# Altium schematic sheet Simple_Foc_Core.schdoc
size 278 x 207 mm
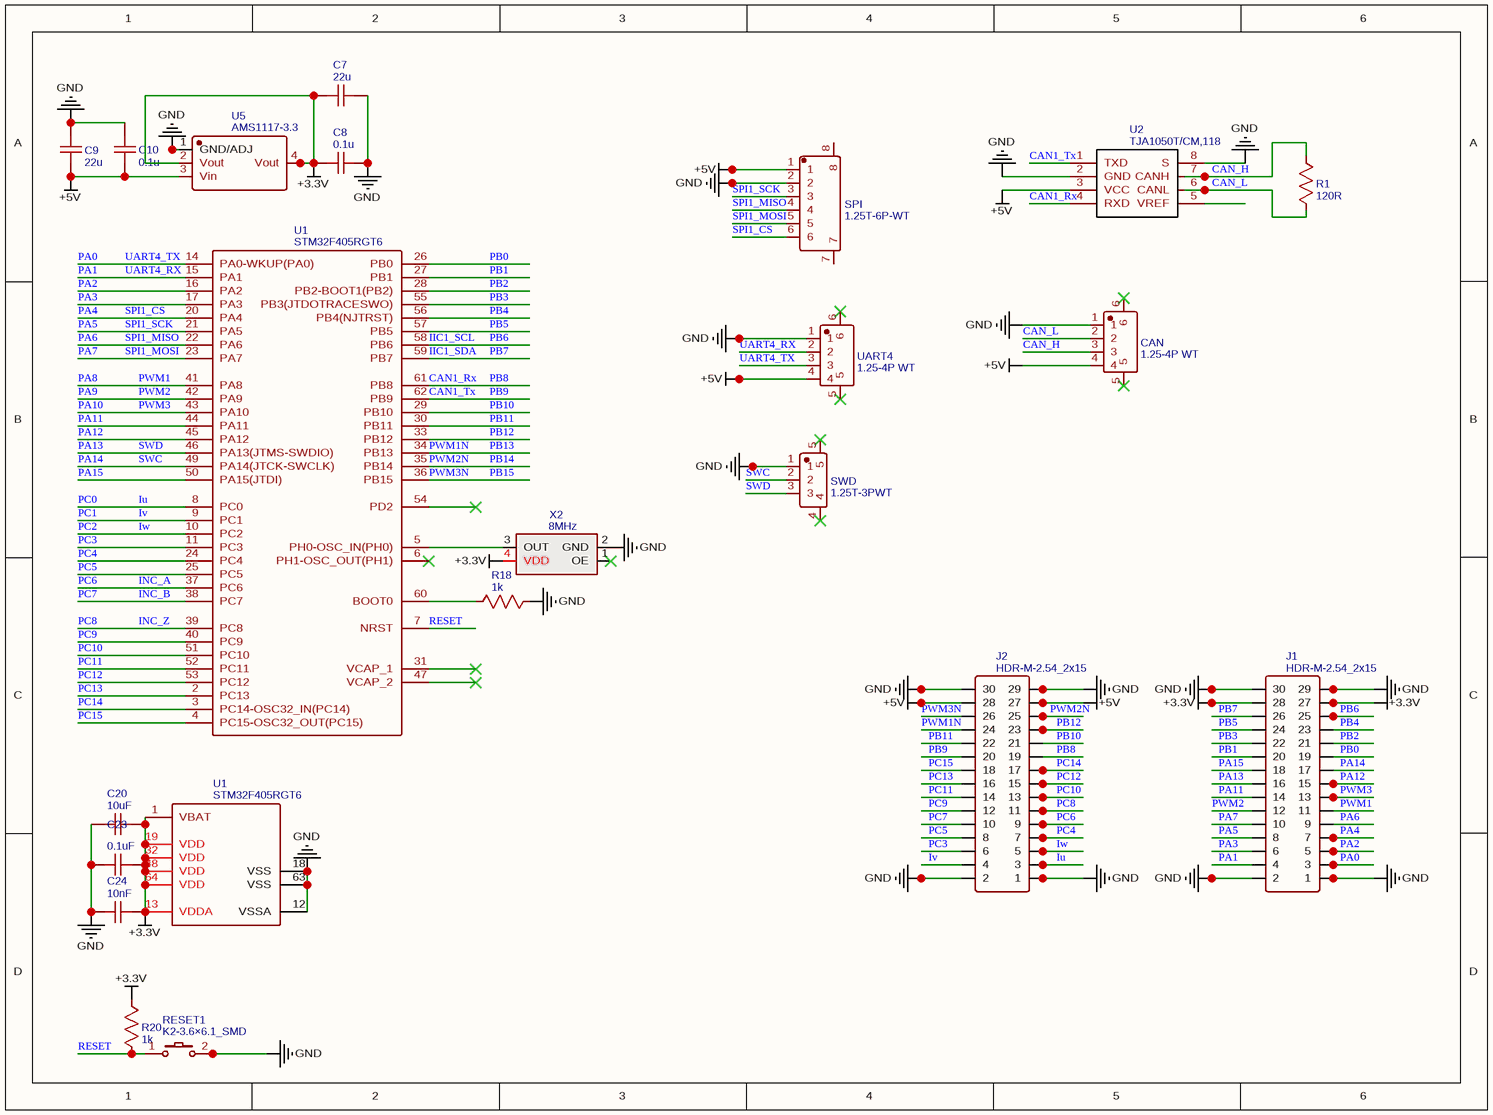
[diagram p0: Simple_Foc_Core.schdoc]

## Parts
(Parts that share a designator on the sheet are numbered #1, #2 ... from top to bottom, then left to right.)
C7  22u  [C0603]
C8  0.1u  [C0603]
C9  22u  [C0603]
C10  0.1u  [C0603]
C20  10uF  [C0603]
C23  0.1uF  [C0603]
C24  10nF  [C0603]
CAN  1.25-4P WT  [CONN-SMD_1.25-4PWT]
J1  HDR-M-2.54_2x15  [HDR-M-2.54_2X15]
J2  HDR-M-2.54_2x15  [HDR-M-2.54_2X15]
R1  120R  [R0603]
R18  1k  [R0603]
R20  1k  [R0603]
RESET1  K2-3.6×6.1_SMD  [KEY-SMD_2P-L6.2-W3.6-LS8.0]
SPI  1.25T-6P-WT  [CONN-SMD_6P-P1.25_1.25T-6P-WT]
SWD  1.25T-3PWT  [CONN-SMD_3P-P1.25_1.25T-3PWT]
U1#1  STM32F405RGT6  [LQFP-64_L10.0-W10.0-P0.50-LS12.0-BL]
U1#2  STM32F405RGT6  [LQFP-64_L10.0-W10.0-P0.50-LS12.0-BL]
U2  TJA1050T/CM,118  [SOIC-8_L5.0-W4.0-P1.27-LS6.0-BL]
U5  AMS1117-3.3  [SOT-223-3_L6.5-W3.4-P2.30-LS7.0-BR]
UART4  1.25-4P WT  [CONN-SMD_1.25-4PWT]
X2  8MHz  [OSC-SMD_4P-L3.2-W2.5-BL]

## Nets
+3.3V: C7.1 C8.1 C20.2 C23.1 C24.1 J1.27 J1.28 R20.2 U1#2.1(VBAT) U1#2.13(VDDA) U1#2.19(VDD) U1#2.32(VDD) U1#2.48(VDD) U1#2.64(VDD) U5.2(Vout) U5.4(Vout) X2.4(VDD)
+5V: C9.1 C10.1 CAN.4 J2.27 J2.28 SPI.1 U2.3(VCC) U5.3(Vin) UART4.4
GND: C7.2 C8.2 C9.2 C10.2 C20.1 C23.2 C24.2 CAN.1 J1.1 J1.2 J1.29 J1.30 J2.1 J2.2 J2.29 J2.30 R18.1 RESET1.2 SPI.2 SWD.1 U1#2.12(VSSA) U1#2.18(VSS) U1#2.63(VSS) U2.2(GND) U2.8(S) U5.1(GND/ADJ) UART4.1 X2.2(GND)
CAN1_Rx: J2.19 U1#1.61(PB8) U2.4(RXD)  [also labelled PB8]
CAN1_Tx: J2.20 U1#1.62(PB9) U2.1(TXD)  [also labelled PB9]
CAN_H: CAN.3 R1.1 U2.7(CANH)
CAN_L: CAN.2 R1.2 U2.6(CANL)
IIC1_SCL: J1.25 U1#1.58(PB6)  [also labelled PB6]
IIC1_SDA: J1.26 U1#1.59(PB7)  [also labelled PB7]
INC_A: J2.9 U1#1.37(PC6)  [also labelled PC6]
INC_B: J2.10 U1#1.38(PC7)  [also labelled PC7]
INC_Z: J2.11 U1#1.39(PC8)  [also labelled PC8]
Iu: J2.3 U1#1.8(PC0)  [also labelled PC0]
Iv: J2.4 U1#1.9(PC1)  [also labelled PC1]
Iw: J2.5 U1#1.10(PC2)  [also labelled PC2]
PA0: J1.3 U1#1.14(PA0-WKUP(PA0)) UART4.3  [also labelled UART4_TX]
PA1: J1.4 U1#1.15(PA1) UART4.2  [also labelled UART4_RX]
PA2: J1.5 U1#1.16(PA2)
PA3: J1.6 U1#1.17(PA3)
PA4: J1.7 SPI.6 U1#1.20(PA4)  [also labelled SPI1_CS]
PA5: J1.8 SPI.3 U1#1.21(PA5)  [also labelled SPI1_SCK]
PA6: J1.9 SPI.4 U1#1.22(PA6)  [also labelled SPI1_MISO]
PA7: J1.10 SPI.5 U1#1.23(PA7)  [also labelled SPI1_MOSI]
PA8: J1.11 U1#1.41(PA8)  [also labelled PWM1]
PA9: J1.12 U1#1.42(PA9)  [also labelled PWM2]
PA10: J1.13 U1#1.43(PA10)  [also labelled PWM3]
PA11: J1.14 U1#1.44(PA11)
PA12: J1.15 U1#1.45(PA12)
PA13: J1.16 SWD.3 U1#1.46(PA13(JTMS-SWDIO))  [also labelled SWD]
PA14: J1.17 SWD.2 U1#1.49(PA14(JTCK-SWCLK))  [also labelled SWC]
PA15: J1.18 U1#1.50(PA15(JTDI))
PB0: J1.19 U1#1.26(PB0)
PB1: J1.20 U1#1.27(PB1)
PB2: J1.21 U1#1.28(PB2-BOOT1(PB2))
PB3: J1.22 U1#1.55(PB3(JTDOTRACESWO))
PB4: J1.23 U1#1.56(PB4(NJTRST))
PB5: J1.24 U1#1.57(PB5)
PB10: J2.21 U1#1.29(PB10)
PB11: J2.22 U1#1.30(PB11)
PB12: J2.23 U1#1.33(PB12)
PB13: J2.24 U1#1.34(PB13)  [also labelled PWM1N]
PB14: J2.25 U1#1.35(PB14)  [also labelled PWM2N]
PB15: J2.26 U1#1.36(PB15)  [also labelled PWM3N]
PC3: J2.6 U1#1.11(PC3)
PC4: J2.7 U1#1.24(PC4)
PC5: J2.8 U1#1.25(PC5)
PC9: J2.12 U1#1.40(PC9)
PC10: J2.13 U1#1.51(PC10)
PC11: J2.14 U1#1.52(PC11)
PC12: J2.15 U1#1.53(PC12)
PC13: J2.16 U1#1.2(PC13)
PC14: J2.17 U1#1.3(PC14-OSC32_IN(PC14))
PC15: J2.18 U1#1.4(PC15-OSC32_OUT(PC15))
RESET: R20.1 RESET1.1 U1#1.7(NRST)
NetR18_2: R18.2 U1#1.60(BOOT0)
NetU1#1_5: U1#1.5(PH0-OSC_IN(PH0)) X2.3(OUT)

Not connected (* = marked no-connect by the designer): CAN 5* 6*; SPI 7 8; SWD 4* 5*; U1#1 6(PH1-OSC_OUT(PH1))* 31(VCAP_1)* 47(VCAP_2)* 54(PD2)*; U2 5(VREF); UART4 5* 6*; X2 1(OE)*

## Library data of the parts
C7 C9 = 22u: nameAlias: Value(F); Contributor: LCEDA_Lib; spicePre: C; spiceSymbolName: C_0603_US
C8 C10 = 0.1u: nameAlias: Value(F); Contributor: LCEDA_Lib; spicePre: C; spiceSymbolName: C_0603_US
C20 = 10uF: nameAlias: Value(F); Contributor: LCEDA_Lib; spicePre: C; spiceSymbolName: C_0603_US
C23 = 0.1uF: nameAlias: Value(F); Contributor: LCEDA_Lib; spicePre: C; spiceSymbolName: C_0603_US
C24 = 10nF: nameAlias: Value(F); Contributor: LCEDA_Lib; spicePre: C; spiceSymbolName: C_0603_US
CAN UART4 = 1.25-4P WT: BOM_Manufacturer: SHOU HAN; Contributor: LCSC; Package Display: No; BOM_Supplier: LCSC; BOM_Supplier Part: C668615; BOM_Manufacturer Part: 1.25-4P WT; BOM_JLCPCB Part Class: Extended Part; spicePre: C; spiceSymbolName: 1.25-4P WT
J1 J2 = HDR-M-2.54_2x15: Contributor: LCEDA_Lib; BOM_Supplier Part: C56496; BOM_Supplier: LCSC; spicePre: J; spiceSymbolName: HDR-M-2.54_2x15
R1 = 120R: nameAlias: Value(Ω); Contributor: LCEDA_Lib; spicePre: R; spiceSymbolName: R_0603_US
R18 R20 = 1k: nameAlias: Value(Ω); Contributor: LCEDA_Lib; spicePre: R; spiceSymbolName: R_0603_US
RESET1 = K2-3.6×6.1_SMD: BOM_Manufacturer Part: K2-1107ST-A4SW-06; Contributor: LCEDA_Lib; 制造商: 韩国韩荣; BOM_Supplier Part: C118141; BOM_Supplier: LCSC; spicePre: K; spiceSymbolName: K2-3.6×6.1_SMD
SPI = 1.25T-6P-WT: BOM_Manufacturer: HRO; Contributor: huyanghong; BOM_Supplier: LCSC; BOM_Manufacturer Part: 1.25T-6P-WT; BOM_Supplier Part: C97377; BOM_JLCPCB Part Class: Extended Part; spicePre: C; spiceSymbolName: 1.25T-6P-WT
SWD = 1.25T-3PWT: BOM_Manufacturer: BOOMELE; spicePre: X; BOM_Supplier: LCSC; BOM_Manufacturer Part: 1.25T-3PWT; BOM_Supplier Part: C22075; BOM_JLCPCB Part Class: Extended Part; spiceSymbolName: 1.25T-3PWT
U1#1 U1#2 = STM32F405RGT6: BOM_Manufacturer: ST; subpart_no: 1; tags: STM32; BOM_Supplier Part: C15742; BOM_Supplier: LCSC; BOM_Manufacturer Part: STM32F405RGT6; image: http://image.lceda.cn/szlcsc/C15742.jpg; BOM_JLCPCB Part Class: Extended Part; spicePre: U; spiceSymbolName: STM32F405RGT6
U2 = TJA1050T/CM,118: BOM_Manufacturer: NXP; BOM_Supplier: LCSC; BOM_Manufacturer Part: TJA1050T/CM,118; BOM_Supplier Part: C6952; BOM_JLCPCB Part Class: Basic Part; spicePre: U; spiceSymbolName: TJA1050T/CM,118
U5 = AMS1117-3.3: BOM_Manufacturer: AMS; sourceId: dwIGgezVh; timeStamp: 1476261164; BOM_Supplier: LCSC; BOM_Manufacturer Part: AMS1117-3.3; BOM_Supplier Part: C6186; BOM_JLCPCB Part Class: Basic Part; spicePre: U; spiceSymbolName: AMS1117-3.3
X2 = 8MHz: BOM_Manufacturer: YXC; BOM_Manufacturer Part: O32253579545MHEA4SI-1; nameAlias: Frequency; BOM_Supplier: LCSC; BOM_Supplier Part: C70606; BOM_JLCPCB Part Class: Extended Part; spicePre: X; spiceSymbolName: O32253579545MHEA4SI-1